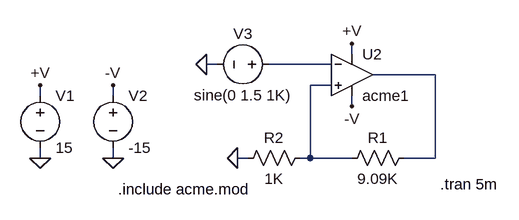
[diagram p0: schematic CallACME1.asc]
CallACME1.asc, the LTspice schematic file:
Version 4
SHEET 1 880 680
WIRE 192 144 192 128
WIRE -16 160 -32 160
WIRE 160 160 64 160
WIRE 320 176 224 176
WIRE 160 192 128 192
WIRE -288 208 -288 192
WIRE -176 208 -176 192
WIRE 192 224 192 208
WIRE -288 304 -288 288
WIRE -176 304 -176 288
WIRE 32 304 16 304
WIRE 128 304 128 192
WIRE 128 304 112 304
WIRE 192 304 128 304
WIRE 320 304 320 176
WIRE 320 304 272 304
FLAG -288 304 0
FLAG -176 304 0
FLAG 192 128 +V
FLAG 16 304 0
FLAG -288 192 +V
FLAG -176 192 -V
FLAG 192 224 -V
FLAG -32 160 0
SYMBOL voltage -288 192 R0
SYMATTR InstName V1
SYMATTR Value 15
SYMBOL voltage -176 192 R0
SYMATTR InstName V2
SYMATTR Value -15
SYMBOL res 288 288 R90
WINDOW 0 0 56 VBottom 0
WINDOW 3 32 56 VTop 0
SYMATTR InstName R1
SYMATTR Value 9.09K
SYMBOL res 128 288 R90
WINDOW 0 0 56 VBottom 0
WINDOW 3 32 56 VTop 0
SYMATTR InstName R2
SYMATTR Value 1K
SYMBOL voltage 80 160 M270
WINDOW 0 32 56 VTop 0
WINDOW 3 -32 56 VBottom 0
SYMATTR InstName V3
SYMATTR Value sine(0 1.5 1K)
SYMBOL Opamps\\opamp2 192 112 R0
SYMATTR InstName U2
SYMATTR Value acme1
TEXT 328 344 Left 0 !.tran 5m
TEXT -168 352 Left 0 !.include acme.mod

The netlist it stands for:
* CallACME1.asc
V1 +V 0 15
V2 -V 0 -15
R1 N002 N003 9.09K
R2 N003 0 1K
V3 N001 0 sine(0 1.5 1K)
XU2 N003 N001 +V -V N002 acme1  ; pins In+ In- V+ V- OUT
.tran 5m
.include acme.mod
.backanno
.end